# Altium schematic sheet пример схемы с элементами.SchDoc: Суперблок
size 209 x 297 mm; ApprovedBy: Петров; CheckedBy: Сидоров; DrawnBy: Пупкин; Organization: Фирма; DocumentNumber: БЛАБЛА2.100; SheetTotal: 1; FirstApply: БЛАБЛА2
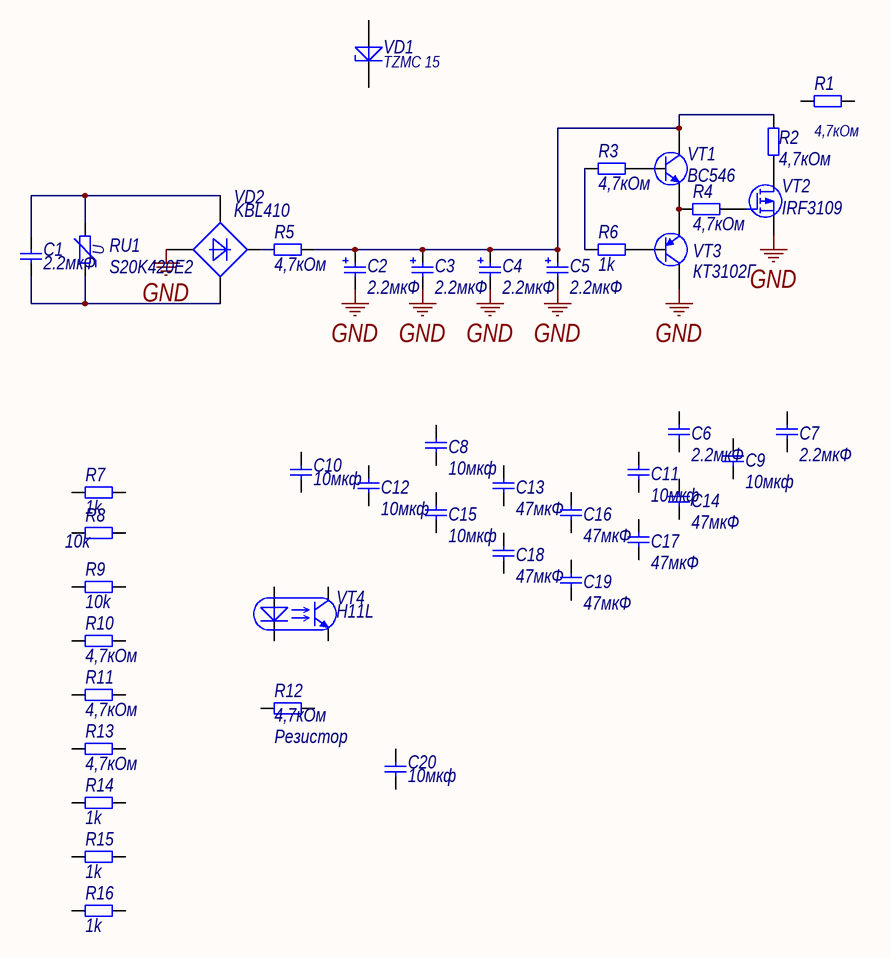
[diagram p0: пример схемы с элементами.SchDoc]

## Parts
C1  2.2мкФ
C2  2.2мкФ
C3  2.2мкФ
C4  2.2мкФ
C5  2.2мкФ
C6  2.2мкФ
C7  2.2мкФ
C8  10мкф
C9  10мкф
C10  10мкф
C11  10мкф
C12  10мкф
C13  47мкФ
C14  47мкФ
C15  10мкф
C16  47мкФ
C17  47мкФ
C18  47мкФ
C19  47мкФ
C20  10мкф
R1  4,7кОм
R2  4,7кОм
R3  4,7кОм
R4  4,7кОм
R5  4,7кОм
R6  1k
R7  1k
R8  10k
R9  10k
R10  4,7кОм
R11  4,7кОм
R12  4,7кОм
R13  4,7кОм
R14  1k
R15  1k
R16  1k
RU1  S20K420E2
VD1  TZMC 15
VD2  KBL410
VT1  BC546
VT2  IRF3109
VT3  КТ3102Г
VT4  H11L

## Nets
GND: C2.2 C3.2 C4.2 C5.2 VD2.1(A) VT2.3(S) VT3.3(C)
NetC1_1: C1.1 RU1.2 VD2.2(C)
NetC1_2: C1.2 RU1.1 VD2.4(C)
NetC2_1: C2.1 C3.1 C4.1 C5.1 R2.2 R5.2 VT1.1(C)
NetR2_1: R2.1 VT2.1(D)
NetR3_1: R3.1 R6.1
NetR3_2: R3.2 VT1.2(B)
NetR4_1: R4.1 VT1.3(E) VT3.1(E)
NetR4_2: R4.2 VT2.2(G)
NetR5_1: R5.1 VD2.3(K)
NetR6_2: R6.2 VT3.2(B)

Not connected (* = marked no-connect by the designer): C6 1 2; C7 1 2; C8 1 2; C9 1 2; C10 1 2; C11 1 2; C12 1 2; C13 1 2; C14 1 2; C15 1 2; C16 1 2; C17 1 2; C18 1 2; C19 1 2; C20 1 2; R1 1 2; R7 1 2; R8 1 2; R9 1 2; R10 1 2; R11 1 2; R12 1 2; R13 1 2; R14 1 2; R15 1 2; R16 1 2; VD1 1(A) 2(K); VT4 1(A) 2(K) 3(C) 4(E)

## Notes on the sheet
- Перв. примен.
- Справ.№
- Подп.и дата
- Инв.№ дубл.
- Взам.инв.№
- Подп. и дата
- Изм.
- Лист
- №докум.
- Подп.
- Дата
- Лит.
- Масса
- Масштаб
- Пров.
- Т.контр.
- Разраб.
- Схема электрическая принципиальная
- Лист:
- Листов:
- Инв.№ подл.
- Согласовано
- Н.контр.
- Утв.
- Копировал:
- Формат А4
- (in symbol RU Varistor) U

## Library data of the parts
C1 C6 C7 = C nonpol: Конденсатор неполярный; Manufacturer: Murata; Power/Voltage: 50В; Tolerance: 10%; Name: 1206; TKE/TKC: X7R; BCPId: *; ManufacturerPartNumber: *; Rem: *; Package: *; Value: 2.2мкФ; Type: Конденсатор; TU/GOST: *; ValueBOM: *
C2-C5 = C pol: Конденсатор полярный; Manufacturer: Murata; Power/Voltage: 50В; Tolerance: 10%; Name: 1206; TKE/TKC: X7R; BCPId: *; ManufacturerPartNumber: *; Rem: *; Package: *; Value: 2.2мкФ; Type: Конденсатор; TU/GOST: *; ValueBOM: *
C8-C12 C15 C20 = C nonpol: Конденсатор неполярный; Manufacturer: Hitano; ManufacturerPartNumber: ELV10106FKS2112; Power/Voltage: 450В; Tolerance: -20...+80%; Name: ELV; BCPId: *; Rem: *; Package: *; Value: 10мкф; Type: Конденсатор; TU/GOST: *; TKE/TKC: *; ValueBOM: *
C13 C14 C16-C19 = C nonpol: Конденсатор неполярный; Power/Voltage: 20В; TU/GOST: ОЖО.464.136 ТУ; Tolerance: +/-10%; Name: К53-18; TKE/TKC: В; BCPId: *; Manufacturer: *; ManufacturerPartNumber: *; Rem: *; Package: *; Value: 47мкФ; Type: Конденсатор; ValueBOM: *
R1-R5 R10 R12 R13 = R: Резистор; Power/Voltage: 0,125; Tolerance: +/-5%; TU/GOST: АЛЯР.431.110.005 ТУ; Name: Р1-12; TKE/TKC: М; BCPId: *; Manufacturer: *; ManufacturerPartNumber: *; Rem: *; Package: *; Value: 4,7кОм; Type: Резистор; ValueBOM: *
R6 R7 R14-R16 = R: Резистор; Tolerance: 0.1%; Name: 1206; BCPId: *; Power/Voltage: *; Manufacturer: *; ManufacturerPartNumber: *; Rem: *; Package: *; Value: 1k; TU/GOST: *; Type: Резистор; TKE/TKC: *; ValueBOM: *
R8 = R: Резистор; Manufacturer: Yageo; ManufacturerPartNumber: 1206R103BLABLA; Tolerance: 0.1%; Name: 1206; BCPId: *; Power/Voltage: *; Rem: *; Package: *; Value: 10k; TU/GOST: *; Type: Резистор; TKE/TKC: *; ValueBOM: *
R9 = R: Резистор; Manufacturer: Yageo; ManufacturerPartNumber: 1206R103BLABLA; BCPId: *; Power/Voltage: *; Tolerance: *; Rem: *; Package: *; Value: 10k; TU/GOST: *; Type: Резистор; Name: *; TKE/TKC: *; ValueBOM: *
R11 = R: Резистор; ManufacturerPartNumber: Р1-12 - 0,125ФИ - 4,7кОм +/-5% - М; TU/GOST: АЛЯР.431.110.005 ТУ; BCPId: *; Power/Voltage: *; Tolerance: *; Manufacturer: *; Rem: *; Package: *; Value: 4,7кОм; Type: Резистор; Name: *; TKE/TKC: *; ValueBOM: *
RU1 = RU Varistor: Варистор; Manufacturer: Epcos; BCPId: *; Rem: *; Package: *; ManufacturerPartNumber: S20K420E2; Type: Варистор; TU/GOST: *
VD1 = VD Stabilitron: Стабилитрон односторонний; Manufacturer: Vishay; BCPId: *; Rem: *; Package: *; ManufacturerPartNumber: TZMC 15; Type: Стабилитрон; TU/GOST: *
VD2 = VD Bridge diod: Диодный мост; BCPId: *; Manufacturer: *; Rem: *; Package: *; ManufacturerPartNumber: KBL410; Type: Диодный мост; TU/GOST: *
VT1 = VT Transistor NPN: Транзистор биполярный n-p-n; Manufacturer: Vishay; BCPId: *; Rem: *; Package: *; ManufacturerPartNumber: BC546; Type: Транзистор; TU/GOST: *
VT2 = VT Transistor PMOS: Транзистор полевой p-канальный; Manufacturer: IRF; BCPId: *; Rem: *; Package: *; ManufacturerPartNumber: IRF3109; Type: Транзистор; TU/GOST: *
VT3 = VT Transistor PNP: Транзистор биполярный p-n-p; TU/GOST: ТР431.004.005 ТУ; BCPId: *; Manufacturer: *; Rem: *; Package: *; ManufacturerPartNumber: КТ3102Г; Type: Транзистор
VT4 = Optron1: Оптрон транзисторный; Manufacturer: BurrBrown; BCPId: *; Rem: *; Package: *; ManufacturerPartNumber: H11L; Type: Оптрон; TU/GOST: *